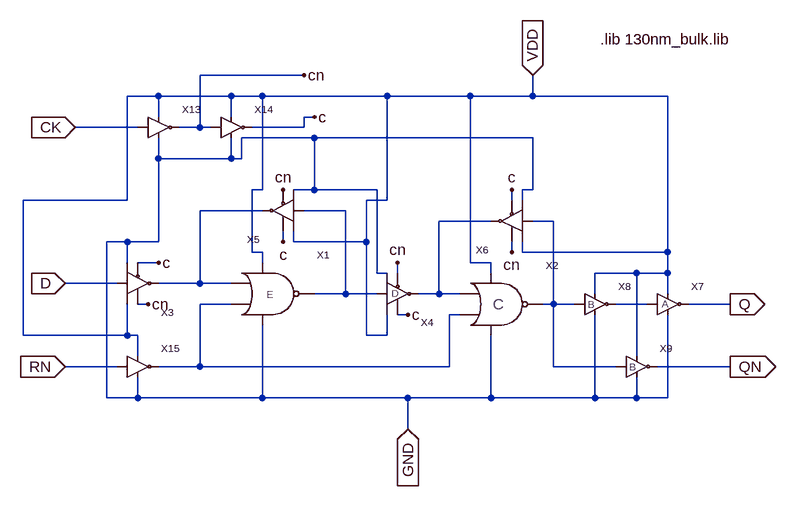
[diagram p0: schematic FFD_RS.asc]
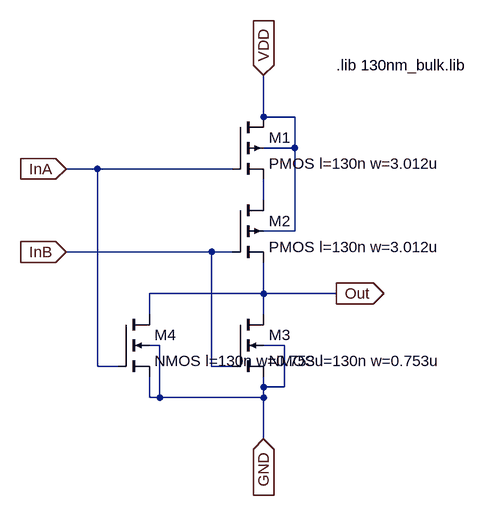
[diagram p1: sub-circuit nor_e.asc]
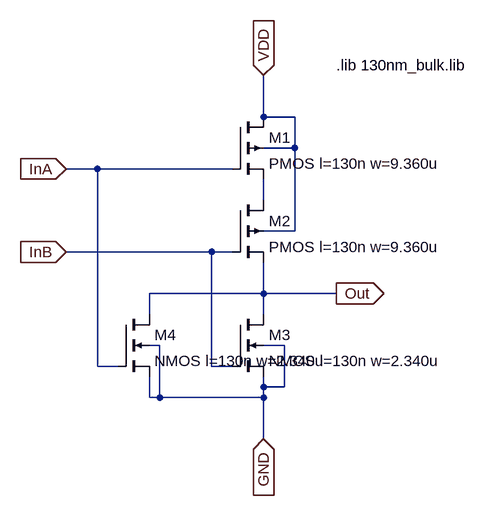
[diagram p2: sub-circuit nor_c.asc]
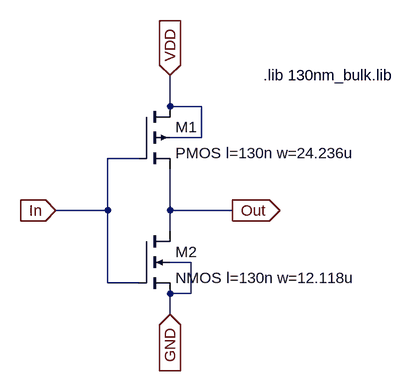
[diagram p3: sub-circuit inverter_a.asc]
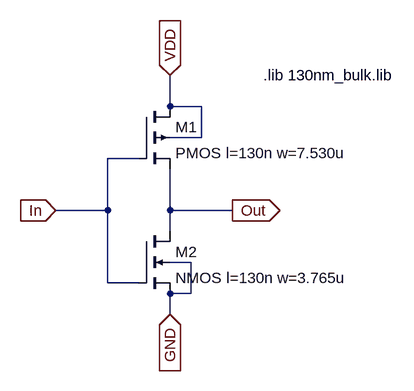
[diagram p4: sub-circuit inverter_b.asc]
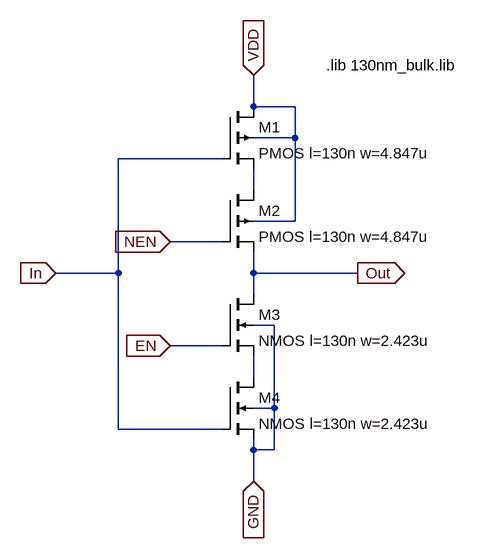
[diagram p5: sub-circuit tristate_inv_d.asc]
FFD_RS.asc, the LTspice schematic file:
Version 4
SHEET 1 1088 680
WIRE 336 -64 176 -64
WIRE 112 -32 64 -32
WIRE 224 -32 112 -32
WIRE 272 -32 224 -32
WIRE 464 -32 272 -32
WIRE 592 -32 464 -32
WIRE 688 -32 688 -64
WIRE 688 -32 592 -32
WIRE 896 -32 688 -32
WIRE 112 0 112 -32
WIRE 224 0 224 -32
WIRE 352 0 336 0
WIRE 80 16 -16 16
WIRE 176 16 176 -64
WIRE 176 16 144 16
WIRE 192 16 176 16
WIRE 336 16 336 0
WIRE 336 16 256 16
WIRE 352 32 240 32
WIRE 688 32 352 32
WIRE 112 64 112 32
WIRE 224 64 224 32
WIRE 224 64 112 64
WIRE 240 64 240 32
WIRE 240 64 224 64
WIRE 272 112 272 -32
WIRE 272 112 256 112
WIRE 352 112 352 32
WIRE 352 112 320 112
WIRE 448 112 352 112
WIRE 688 112 688 32
WIRE 688 112 672 112
WIRE 64 128 64 -32
WIRE 64 128 -96 128
WIRE 464 128 464 -32
WIRE 464 128 432 128
WIRE 656 128 656 112
WIRE 672 128 672 112
WIRE 272 144 176 144
WIRE 400 144 336 144
WIRE 624 160 544 160
WIRE 720 160 688 160
WIRE 64 192 32 192
WIRE 112 192 112 64
WIRE 112 192 64 192
WIRE 304 192 304 176
WIRE 320 192 320 176
WIRE 432 192 432 128
WIRE 432 192 320 192
WIRE 256 208 256 112
WIRE 272 208 256 208
WIRE 656 208 656 192
WIRE 672 208 672 192
WIRE 896 208 896 -32
WIRE 896 208 672 208
WIRE 64 224 64 192
WIRE 112 224 80 224
WIRE 272 224 272 208
WIRE 592 224 592 -32
WIRE 624 224 592 224
WIRE 448 240 448 112
WIRE 464 240 448 240
WIRE 480 240 480 224
WIRE 624 240 624 224
WIRE 848 240 784 240
WIRE 896 240 896 208
WIRE 896 240 848 240
WIRE 48 256 -32 256
WIRE 176 256 176 144
WIRE 176 256 112 256
WIRE 224 256 176 256
WIRE 400 272 400 144
WIRE 400 272 352 272
WIRE 448 272 400 272
WIRE 544 272 544 160
WIRE 544 272 512 272
WIRE 576 272 544 272
WIRE 784 272 784 240
WIRE 896 272 896 240
WIRE 96 288 80 288
WIRE 224 288 176 288
WIRE 720 288 720 160
WIRE 720 288 704 288
WIRE 752 288 720 288
WIRE 864 288 816 288
WIRE 992 288 928 288
WIRE 496 304 480 304
WIRE 576 304 560 304
WIRE -96 336 -96 128
WIRE 64 336 64 288
WIRE 64 336 -96 336
WIRE 80 336 64 336
WIRE 432 336 432 192
WIRE 464 336 464 304
WIRE 464 336 432 336
WIRE 80 368 80 336
WIRE 848 368 848 240
WIRE 48 384 -32 384
WIRE 176 384 176 288
WIRE 176 384 112 384
WIRE 560 384 560 304
WIRE 560 384 176 384
WIRE 720 384 720 288
WIRE 816 384 720 384
WIRE 992 384 880 384
WIRE 32 432 32 192
WIRE 80 432 80 400
WIRE 80 432 32 432
WIRE 272 432 272 320
WIRE 272 432 80 432
WIRE 496 432 272 432
WIRE 624 432 624 336
WIRE 624 432 496 432
WIRE 784 432 784 304
WIRE 784 432 624 432
WIRE 848 432 848 400
WIRE 848 432 784 432
WIRE 896 432 896 304
WIRE 896 432 848 432
WIRE 496 480 496 432
FLAG -16 16 CK
IOPIN -16 16 In
FLAG -32 384 RN
IOPIN -32 384 In
FLAG -32 256 D
IOPIN -32 256 In
FLAG 992 288 Q
IOPIN 992 288 Out
FLAG 992 384 QN
IOPIN 992 384 Out
FLAG 688 -64 VDD
IOPIN 688 -64 In
FLAG 496 480 GND
IOPIN 496 480 In
FLAG 336 -64 cn
FLAG 352 0 c
FLAG 112 224 c
FLAG 656 112 c
FLAG 96 288 cn
FLAG 656 208 cn
FLAG 480 224 cn
FLAG 304 112 cn
FLAG 304 192 c
FLAG 496 304 c
SYMBOL Inverter 144 32 R0
SYMATTR InstName X13
SYMBOL Inverter 256 32 R0
SYMATTR InstName X14
SYMBOL Inverter 112 400 R0
SYMATTR InstName X15
SYMBOL NOR_E 256 272 R0
SYMATTR InstName X1
SYMBOL NOR_C 608 288 R0
SYMATTR InstName X2
SYMBOL Inverter_A 928 304 R0
SYMATTR InstName X7
SYMBOL Inverter_B 816 304 R0
SYMATTR InstName X8
SYMBOL Inverter_B 880 400 R0
SYMATTR InstName X9
SYMBOL Tristate_Inv 240 112 R180
SYMATTR InstName X5
SYMBOL Tristate_Inv 592 128 R180
SYMATTR InstName X6
SYMBOL Tristate_Inv 144 224 M180
SYMATTR InstName X3
SYMBOL Tristate_Inv_D 544 240 M180
SYMATTR InstName X4
TEXT 792 -120 Left 2 !.lib 130nm_bulk.lib

nor_e.asc, the sub-circuit schematic file:
Version 4
SHEET 1 880 680
WIRE 240 16 240 -48
WIRE 288 16 240 16
WIRE 288 64 288 16
WIRE 288 64 240 64
WIRE -16 96 -64 96
WIRE 192 96 -16 96
WIRE 240 144 240 112
WIRE 288 192 288 64
WIRE 288 192 240 192
WIRE 160 224 -64 224
WIRE 192 224 160 224
WIRE 240 288 240 240
WIRE 240 288 64 288
WIRE 352 288 240 288
WIRE 64 320 64 288
WIRE 240 320 240 288
WIRE 80 368 64 368
WIRE 272 368 240 368
WIRE -16 400 -16 96
WIRE 16 400 -16 400
WIRE 160 400 160 224
WIRE 192 400 160 400
WIRE 240 432 240 416
WIRE 272 432 272 368
WIRE 272 432 240 432
WIRE 64 448 64 416
WIRE 80 448 80 368
WIRE 80 448 64 448
WIRE 240 448 240 432
WIRE 240 448 80 448
WIRE 240 512 240 448
FLAG -64 96 InA
IOPIN -64 96 In
FLAG -64 224 InB
IOPIN -64 224 In
FLAG 240 -48 VDD
IOPIN 240 -48 In
FLAG 240 512 GND
IOPIN 240 512 In
FLAG 352 288 Out
IOPIN 352 288 Out
SYMBOL pmos4 192 16 R0
SYMATTR InstName M1
SYMATTR Value2 l=130n w=3.012u
SYMATTR Value PMOS l=130n w=3.012u
SYMBOL pmos4 192 144 R0
SYMATTR InstName M2
SYMATTR Value2 l=130n w=3.012u
SYMATTR Value PMOS l=130n w=3.012u
SYMBOL nmos4 192 320 R0
SYMATTR InstName M3
SYMATTR Value2 l=130n w=0.753u
SYMATTR Value NMOS l=130n w=0.753u
SYMBOL nmos4 16 320 R0
SYMATTR InstName M4
SYMATTR Value2 l=130n w=0.753u
SYMATTR Value NMOS l=130n w=0.753u
TEXT 352 -64 Left 2 !.lib 130nm_bulk.lib

nor_c.asc, the sub-circuit schematic file:
Version 4
SHEET 1 880 680
WIRE 240 16 240 -48
WIRE 288 16 240 16
WIRE 288 64 288 16
WIRE 288 64 240 64
WIRE -16 96 -64 96
WIRE 192 96 -16 96
WIRE 240 144 240 112
WIRE 288 192 288 64
WIRE 288 192 240 192
WIRE 160 224 -64 224
WIRE 192 224 160 224
WIRE 240 288 240 240
WIRE 240 288 64 288
WIRE 352 288 240 288
WIRE 64 320 64 288
WIRE 240 320 240 288
WIRE 80 368 64 368
WIRE 272 368 240 368
WIRE -16 400 -16 96
WIRE 16 400 -16 400
WIRE 160 400 160 224
WIRE 192 400 160 400
WIRE 240 432 240 416
WIRE 272 432 272 368
WIRE 272 432 240 432
WIRE 64 448 64 416
WIRE 80 448 80 368
WIRE 80 448 64 448
WIRE 240 448 240 432
WIRE 240 448 80 448
WIRE 240 512 240 448
FLAG -64 96 InA
IOPIN -64 96 In
FLAG -64 224 InB
IOPIN -64 224 In
FLAG 240 -48 VDD
IOPIN 240 -48 In
FLAG 240 512 GND
IOPIN 240 512 In
FLAG 352 288 Out
IOPIN 352 288 Out
SYMBOL pmos4 192 16 R0
SYMATTR InstName M1
SYMATTR Value2 l=130n w=9.360u
SYMATTR Value PMOS l=130n w=9.360u
SYMBOL pmos4 192 144 R0
SYMATTR InstName M2
SYMATTR Value2 l=130n w=9.360u
SYMATTR Value PMOS l=130n w=9.360u
SYMBOL nmos4 192 320 R0
SYMATTR InstName M3
SYMATTR Value2 l=130n w=2.340u
SYMATTR Value NMOS l=130n w=2.340u
SYMBOL nmos4 16 320 R0
SYMATTR InstName M4
SYMATTR Value2 l=130n w=2.340u
SYMATTR Value NMOS l=130n w=2.340u
TEXT 352 -64 Left 2 !.lib 130nm_bulk.lib

inverter_a.asc, the sub-circuit schematic file:
Version 4
SHEET 1 880 680
WIRE 128 16 128 -32
WIRE 176 16 128 16
WIRE 176 64 176 16
WIRE 176 64 128 64
WIRE 80 96 32 96
WIRE 32 176 32 96
WIRE 32 176 -48 176
WIRE 128 176 128 112
WIRE 224 176 128 176
WIRE 128 208 128 176
WIRE 160 256 128 256
WIRE 32 288 32 176
WIRE 80 288 32 288
WIRE 160 304 160 256
WIRE 160 304 128 304
WIRE 128 336 128 304
FLAG 128 -32 VDD
IOPIN 128 -32 In
FLAG 128 336 GND
IOPIN 128 336 In
FLAG -48 176 In
IOPIN -48 176 In
FLAG 224 176 Out
IOPIN 224 176 Out
SYMBOL pmos4 80 16 R0
SYMATTR InstName M1
SYMATTR Value2 l=130n w=24.236u
SYMATTR Value PMOS l=130n w=24.236u
SYMBOL nmos4 80 208 R0
SYMATTR InstName M2
SYMATTR Value2 l=130n w=12.118u
SYMATTR Value NMOS l=130n w=12.118u
TEXT 272 -32 Left 2 !.lib 130nm_bulk.lib

inverter_b.asc, the sub-circuit schematic file:
Version 4
SHEET 1 880 680
WIRE 224 64 224 16
WIRE 272 64 224 64
WIRE 272 112 272 64
WIRE 272 112 224 112
WIRE 176 144 128 144
WIRE 128 224 128 144
WIRE 128 224 48 224
WIRE 224 224 224 160
WIRE 320 224 224 224
WIRE 224 256 224 224
WIRE 256 304 224 304
WIRE 128 336 128 224
WIRE 176 336 128 336
WIRE 256 352 256 304
WIRE 256 352 224 352
WIRE 224 384 224 352
FLAG 224 16 VDD
IOPIN 224 16 In
FLAG 224 384 GND
IOPIN 224 384 In
FLAG 48 224 In
IOPIN 48 224 In
FLAG 320 224 Out
IOPIN 320 224 Out
SYMBOL pmos4 176 64 R0
SYMATTR InstName M1
SYMATTR Value2 l=130n w=7.530u
SYMATTR Value PMOS l=130n w=7.530u
SYMBOL nmos4 176 256 R0
SYMATTR InstName M2
SYMATTR Value2 l=130n w=3.765u
SYMATTR Value NMOS l=130n w=3.765u
TEXT 368 16 Left 2 !.lib 130nm_bulk.lib

tristate_inv_d.asc, the sub-circuit schematic file:
Version 4
SHEET 1 880 768
WIRE 208 80 208 32
WIRE 272 80 208 80
WIRE 272 128 272 80
WIRE 272 128 208 128
WIRE 160 160 0 160
WIRE 208 208 208 176
WIRE 272 256 272 128
WIRE 272 256 208 256
WIRE 160 288 80 288
WIRE 0 336 0 160
WIRE 0 336 -96 336
WIRE 208 336 208 304
WIRE 368 336 208 336
WIRE 208 368 208 336
WIRE 240 416 208 416
WIRE 160 448 80 448
WIRE 208 496 208 464
WIRE 240 544 240 416
WIRE 240 544 208 544
WIRE 0 576 0 336
WIRE 160 576 0 576
WIRE 208 608 208 592
WIRE 240 608 240 544
WIRE 240 608 208 608
WIRE 208 656 208 608
FLAG 208 32 VDD
IOPIN 208 32 In
FLAG 208 656 GND
IOPIN 208 656 In
FLAG -96 336 In
IOPIN -96 336 In
FLAG 80 288 NEN
IOPIN 80 288 In
FLAG 80 448 EN
IOPIN 80 448 In
FLAG 368 336 Out
IOPIN 368 336 Out
SYMBOL pmos4 160 80 R0
SYMATTR InstName M1
SYMATTR Value2 l=130n w=4.847u
SYMATTR Value PMOS l=130n w=4.847u
SYMBOL pmos4 160 208 R0
SYMATTR InstName M2
SYMATTR Value2 l=130n w=4.847u
SYMATTR Value PMOS l=130n w=4.847u
SYMBOL nmos4 160 368 R0
SYMATTR InstName M3
SYMATTR Value2 l=130n w=2.423u
SYMATTR Value NMOS l=130n w=2.423u
SYMBOL nmos4 160 496 R0
SYMATTR InstName M4
SYMATTR Value2 l=130n w=2.423u
SYMATTR Value NMOS l=130n w=2.423u
TEXT 320 16 Left 2 !.lib 130nm_bulk.lib

The netlist it stands for:
* FFD_RS.asc
XX13 CK VDD GND cn Inverter  ; pins In VDD GND Out
XX14 cn VDD GND c Inverter  ; pins In VDD GND Out
XX15 RN VDD GND N005 Inverter  ; pins In VDD GND Out
XX1 N001 N005 VDD GND N002 nor_e
XX2 N003 N005 VDD GND N004 nor_c
XX7 N006 VDD GND Q inverter_a
XX8 N004 VDD GND N006 inverter_b
XX9 N004 VDD GND QN inverter_b
XX5 N002 VDD GND c cn N001 Tristate_Inv  ; pins In VDD GND EN NEN Out
XX6 N004 VDD GND cn c N003 Tristate_Inv  ; pins In VDD GND EN NEN Out
XX3 D VDD GND cn c N001 Tristate_Inv  ; pins In VDD GND EN NEN Out
XX4 N002 VDD GND c cn N003 tristate_inv_d

* block symbol definitions
.subckt nor_e InA InB VDD GND Out
M1 VDD InA N001 VDD PMOS l=130n w=3.012u l=130n w=3.012u
M2 N001 InB Out VDD PMOS l=130n w=3.012u l=130n w=3.012u
M3 Out InB GND GND NMOS l=130n w=0.753u l=130n w=0.753u
M4 Out InA GND GND NMOS l=130n w=0.753u l=130n w=0.753u
.lib 130nm_bulk.lib
.ends nor_e

.subckt nor_c InA InB VDD GND Out
M1 VDD InA N001 VDD PMOS l=130n w=9.360u l=130n w=9.360u
M2 N001 InB Out VDD PMOS l=130n w=9.360u l=130n w=9.360u
M3 Out InB GND GND NMOS l=130n w=2.340u l=130n w=2.340u
M4 Out InA GND GND NMOS l=130n w=2.340u l=130n w=2.340u
.lib 130nm_bulk.lib
.ends nor_c

.subckt inverter_a In VDD GND Out
M1 VDD In Out VDD PMOS l=130n w=24.236u l=130n w=24.236u
M2 Out In GND GND NMOS l=130n w=12.118u l=130n w=12.118u
.lib 130nm_bulk.lib
.ends inverter_a

.subckt inverter_b In VDD GND Out
M1 VDD In Out VDD PMOS l=130n w=7.530u l=130n w=7.530u
M2 Out In GND GND NMOS l=130n w=3.765u l=130n w=3.765u
.lib 130nm_bulk.lib
.ends inverter_b

.subckt tristate_inv_d In VDD GND EN NEN Out
M1 VDD In N001 VDD PMOS l=130n w=4.847u l=130n w=4.847u
M2 N001 NEN Out VDD PMOS l=130n w=4.847u l=130n w=4.847u
M3 Out EN N002 GND NMOS l=130n w=2.423u l=130n w=2.423u
M4 N002 In GND GND NMOS l=130n w=2.423u l=130n w=2.423u
.lib 130nm_bulk.lib
.ends tristate_inv_d

.model NMOS NMOS
.model PMOS PMOS
.lib standard.mos
.lib 130nm_bulk.lib
.backanno
.end